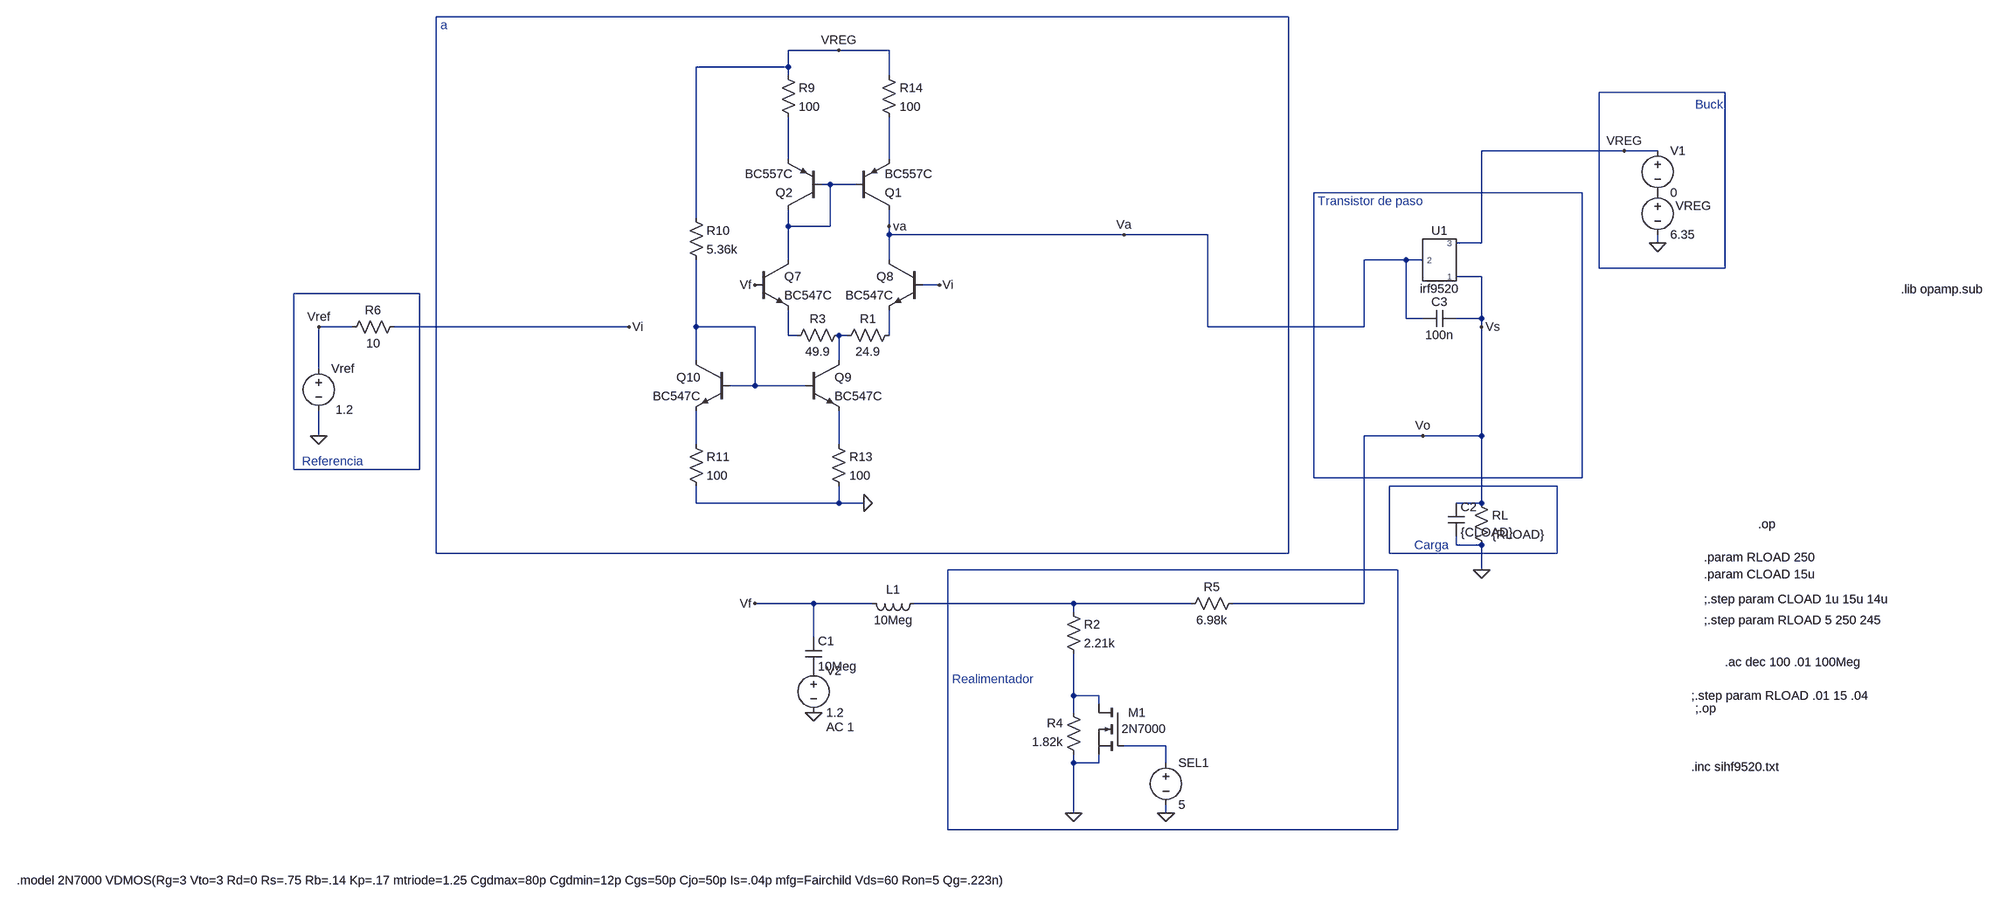
[diagram p0: schematic LDOB_compensadoV.asc]
LDOB_compensadoV.asc, the LTspice schematic file:
Version 4
SHEET 1 26844 1204
WIRE 1264 -480 -512 -480
WIRE 256 -416 160 -416
WIRE 352 -416 256 -416
WIRE 160 -384 160 -416
WIRE 160 -384 -16 -384
WIRE 160 -368 160 -384
WIRE 352 -368 352 -416
WIRE 2096 -336 1856 -336
WIRE 1904 -224 1632 -224
WIRE 1968 -224 1904 -224
WIRE 160 -208 160 -288
WIRE 352 -208 352 -288
WIRE 240 -160 224 -160
WIRE 288 -160 240 -160
WIRE 1824 -144 1312 -144
WIRE -16 -96 -16 -384
WIRE 160 -80 160 -112
WIRE 240 -80 240 -160
WIRE 240 -80 160 -80
WIRE 352 -80 352 -112
WIRE 352 -64 352 -80
WIRE 800 -64 352 -64
WIRE 960 -64 800 -64
WIRE 1632 -48 1632 -224
WIRE 1632 -48 1584 -48
WIRE 1968 -48 1968 -64
WIRE 160 -16 160 -80
WIRE 352 -16 352 -64
WIRE 1488 -16 1408 -16
WIRE 1520 -16 1488 -16
WIRE 1856 0 1856 -336
WIRE 2096 0 2096 -336
WIRE 2096 0 1856 0
WIRE 1632 16 1584 16
WIRE 448 32 416 32
WIRE -544 48 -784 48
WIRE 1488 96 1488 -16
WIRE 1520 96 1488 96
WIRE 1632 96 1632 16
WIRE 1632 96 1584 96
WIRE -672 112 -736 112
WIRE -144 112 -592 112
WIRE -16 112 -16 -16
WIRE 96 112 -16 112
WIRE 960 112 960 -64
WIRE 1408 112 1408 -16
WIRE 1408 112 960 112
WIRE 1632 112 1632 96
WIRE 160 128 160 80
WIRE 176 128 160 128
WIRE 272 128 256 128
WIRE 352 128 352 80
WIRE -16 176 -16 112
WIRE 256 176 256 128
WIRE -736 192 -736 112
WIRE 96 224 96 112
WIRE 96 224 48 224
WIRE 192 224 96 224
WIRE -736 320 -736 272
WIRE 1520 320 1408 320
WIRE 1632 320 1632 112
WIRE 1632 320 1520 320
WIRE -16 336 -16 272
WIRE 256 336 256 272
WIRE -784 384 -784 48
WIRE -544 384 -544 48
WIRE -544 384 -784 384
WIRE 1312 400 1312 -144
WIRE 1824 400 1824 -144
WIRE 1824 400 1312 400
WIRE 1776 416 1456 416
WIRE -16 448 -16 416
WIRE 256 448 256 416
WIRE 256 448 -16 448
WIRE 304 448 256 448
WIRE 1632 448 1632 320
WIRE 1632 448 1584 448
WIRE 1584 528 1584 512
WIRE 1632 528 1584 528
WIRE -512 544 -512 -480
WIRE 1264 544 1264 -480
WIRE 1264 544 -512 544
WIRE 1456 544 1456 416
WIRE 1776 544 1776 416
WIRE 1776 544 1456 544
WIRE 1472 576 464 576
WIRE 1632 576 1632 528
WIRE 208 640 96 640
WIRE 320 640 208 640
WIRE 704 640 400 640
WIRE 928 640 704 640
WIRE 1408 640 1408 320
WIRE 1408 640 1008 640
WIRE 704 656 704 640
WIRE 208 704 208 640
WIRE 704 816 704 736
WIRE 752 816 704 816
WIRE 752 832 752 816
WIRE 704 848 704 816
WIRE 880 912 800 912
WIRE 704 944 704 928
WIRE 752 944 752 928
WIRE 752 944 704 944
WIRE 880 944 880 912
WIRE 704 1040 704 944
WIRE 880 1040 880 1024
WIRE 464 1072 464 576
WIRE 1472 1072 1472 576
WIRE 1472 1072 464 1072
FLAG 1632 576 0
FLAG -736 320 0
FLAG 800 -64 Va
FLAG -736 112 Vref
FLAG 1520 320 Vo
FLAG 1968 -48 0
FLAG 96 640 Vf
FLAG -144 112 Vi
FLAG 1904 -224 VREG
FLAG 1632 112 Vs
FLAG 208 848 0
FLAG 304 448 0
FLAG 256 -416 VREG
FLAG 352 -80 va
FLAG 448 32 Vi
FLAG 96 32 Vf
FLAG 704 1040 0
FLAG 880 1040 0
SYMBOL voltage -736 176 R0
WINDOW 123 0 0 Left 0
WINDOW 39 0 0 Left 0
WINDOW 3 66 94 Right 2
SYMATTR Value 1.2
SYMATTR InstName Vref
SYMBOL res 1616 432 R0
SYMATTR InstName RL
SYMATTR Value {RLOAD}
SYMBOL voltage 1968 -160 R0
WINDOW 123 0 0 Left 0
WINDOW 39 0 0 Left 0
WINDOW 0 34 41 Left 2
SYMATTR InstName VREG
SYMATTR Value 6.35
SYMBOL voltage 1968 -240 R0
WINDOW 123 0 0 Left 0
WINDOW 39 0 0 Left 0
SYMATTR InstName V1
SYMATTR Value 0
SYMBOL res -576 96 R90
WINDOW 0 0 56 VBottom 2
WINDOW 3 32 56 VTop 2
SYMATTR InstName R6
SYMATTR Value 10
SYMBOL ind 416 624 R90
WINDOW 0 5 56 VBottom 2
WINDOW 3 32 56 VTop 2
SYMATTR InstName L1
SYMATTR Value 10Meg
SYMBOL cap 192 704 R0
SYMATTR InstName C1
SYMATTR Value 10Meg
SYMBOL voltage 208 752 R0
WINDOW 123 24 124 Left 2
WINDOW 39 0 0 Left 0
SYMATTR Value2 AC 1
SYMATTR InstName V2
SYMATTR Value 1.2
SYMBOL cap 1568 448 R0
SYMATTR InstName C2
SYMATTR Value {CLOAD}
SYMBOL npn 96 -16 R0
SYMATTR InstName Q7
SYMATTR Value BC547C
SYMBOL npn 416 -16 M0
SYMATTR InstName Q8
SYMATTR Value BC547C
SYMBOL res 144 -384 R0
SYMATTR InstName R9
SYMATTR Value 100
SYMBOL npn 192 176 R0
SYMATTR InstName Q9
SYMATTR Value BC547C
SYMBOL npn 48 176 M0
SYMATTR InstName Q10
SYMATTR Value BC547C
SYMBOL res -32 -112 R0
SYMATTR InstName R10
SYMATTR Value 5.36k
SYMBOL res -32 320 R0
SYMATTR InstName R11
SYMATTR Value 100
SYMBOL res 240 320 R0
SYMATTR InstName R13
SYMATTR Value 100
SYMBOL res 336 -384 R0
SYMATTR InstName R14
SYMATTR Value 100
SYMBOL res 688 640 R0
SYMATTR InstName R2
SYMATTR Value 2.21k
SYMBOL res 720 944 R180
WINDOW 0 36 76 Left 2
WINDOW 3 36 40 Left 2
SYMATTR InstName R4
SYMATTR Value 1.82k
SYMBOL res 1024 624 R90
WINDOW 0 0 56 VBottom 2
WINDOW 3 32 56 VTop 2
SYMATTR InstName R5
SYMATTR Value 6.98k
SYMBOL voltage 880 928 R0
WINDOW 123 0 0 Left 0
WINDOW 39 0 0 Left 0
SYMATTR InstName SEL1
SYMATTR Value 5
SYMBOL nmos 800 832 M0
WINDOW 0 -42 16 Left 2
WINDOW 3 -80 47 Left 2
SYMATTR InstName M1
SYMATTR Value 2N7000
SYMBOL cap 1584 80 R90
WINDOW 0 0 32 VBottom 2
WINDOW 3 32 32 VTop 2
SYMATTR InstName C3
SYMATTR Value 100n
SYMBOL pnp 288 -112 M180
SYMATTR InstName Q1
SYMATTR Value BC557C
SYMBOL pnp 224 -112 R180
SYMATTR InstName Q2
SYMATTR Value BC557C
SYMBOL res 368 112 R90
WINDOW 0 0 56 VBottom 2
WINDOW 3 32 56 VTop 2
SYMATTR InstName R1
SYMATTR Value 24.9
SYMBOL res 272 112 R90
WINDOW 0 0 56 VBottom 2
WINDOW 3 32 56 VTop 2
SYMATTR InstName R3
SYMATTR Value 49.9
SYMBOL irf9520 1552 -16 R0
SYMATTR InstName U1
TEXT -768 368 Left 2 ;Referencia
TEXT -504 -464 Left 2 ;a
TEXT 1320 -128 Left 2 ;Transistor de paso
TEXT 1504 528 Left 2 ;Carga
TEXT 2032 816 Left 2 !;.step param RLOAD .01 15 .04
TEXT 2040 840 Left 2 !;.op
TEXT 2040 -312 Left 2 ;Buck
TEXT 2032 952 Left 2 !.inc sihf9520.txt
TEXT -1312 1168 Left 2 !.model 2N7000 VDMOS(Rg=3 Vto=3 Rd=0 Rs=.75 Rb=.14 Kp=.17 mtriode=1.25 Cgdmax=80p Cgdmin=12p Cgs=50p Cjo=50p Is=.04p mfg=Fairchild Vds=60 Ron=5 Qg=.223n)
TEXT 2432 40 Left 2 !.lib opamp.sub
TEXT 2096 752 Left 2 !.ac dec 100 .01 100Meg
TEXT 2056 672 Left 2 !;.step param RLOAD 5 250 245
TEXT 2056 632 Left 2 !;.step param CLOAD 1u 15u 14u
TEXT 2056 584 Left 2 !.param CLOAD 15u
TEXT 2056 552 Left 2 !.param RLOAD 250
TEXT 2160 488 Left 2 !.op
TEXT 472 784 Left 2 ;Realimentador

The netlist it stands for:
* LDOB_compensadoV.asc
Vref Vref 0 1.2
RL Vs 0 {RLOAD}
VREG P001 0 6.35
V1 VREG P001 0
R6 Vi Vref 10
L1 N016 Vf 10Meg
C1 Vf P002 10Meg
V2 P002 0 1.2 AC 1
C2 Vs 0 {CLOAD}
Q7 N005 Vf N009 0 BC547C
Q8 Va Vi N011 0 BC547C
R9 VREG N003 100
Q9 N010 N008 N013 0 BC547C
Q10 N008 N008 N012 0 BC547C
R10 VREG N008 5.36k
R11 N012 0 100
R13 N013 0 100
R14 VREG N004 100
R2 N016 N017 2.21k
R4 0 N017 1.82k
R5 Vs N016 6.98k
V§SEL1 N018 0 5
M1 N017 N018 0 0 2N7000
C3 Vs Va 100n
Q1 Va N005 N004 0 BC557C
Q2 N005 N005 N003 0 BC557C
R1 N011 N010 24.9
R3 N010 N009 49.9
XU1 Vs Va VREG irf9520  ; pins 1 2 3
.model NPN NPN
.model PNP PNP
.lib standard.bjt
.model NMOS NMOS
.model PMOS PMOS
.lib standard.mos
* Referencia
* a
* Transistor de paso
* Carga
;.step param RLOAD .01 15 .04
;.op
* Buck
.inc sihf9520.txt
.model 2N7000 VDMOS(Rg=3 Vto=3 Rd=0 Rs=.75 Rb=.14 Kp=.17 mtriode=1.25 Cgdmax=80p Cgdmin=12p Cgs=50p Cjo=50p Is=.04p mfg=Fairchild Vds=60 Ron=5 Qg=.223n)
.lib opamp.sub
.ac dec 100 .01 100Meg
;.step param RLOAD 5 250 245
;.step param CLOAD 1u 15u 14u
.param CLOAD 15u
.param RLOAD 250
.op
* Realimentador
.lib sihf9520.txt
.backanno
.end